# EAGLE design PCB Telemetria 2020 (EAGLE 9.6.2)

## Sheet 1 of 5: TBEAM
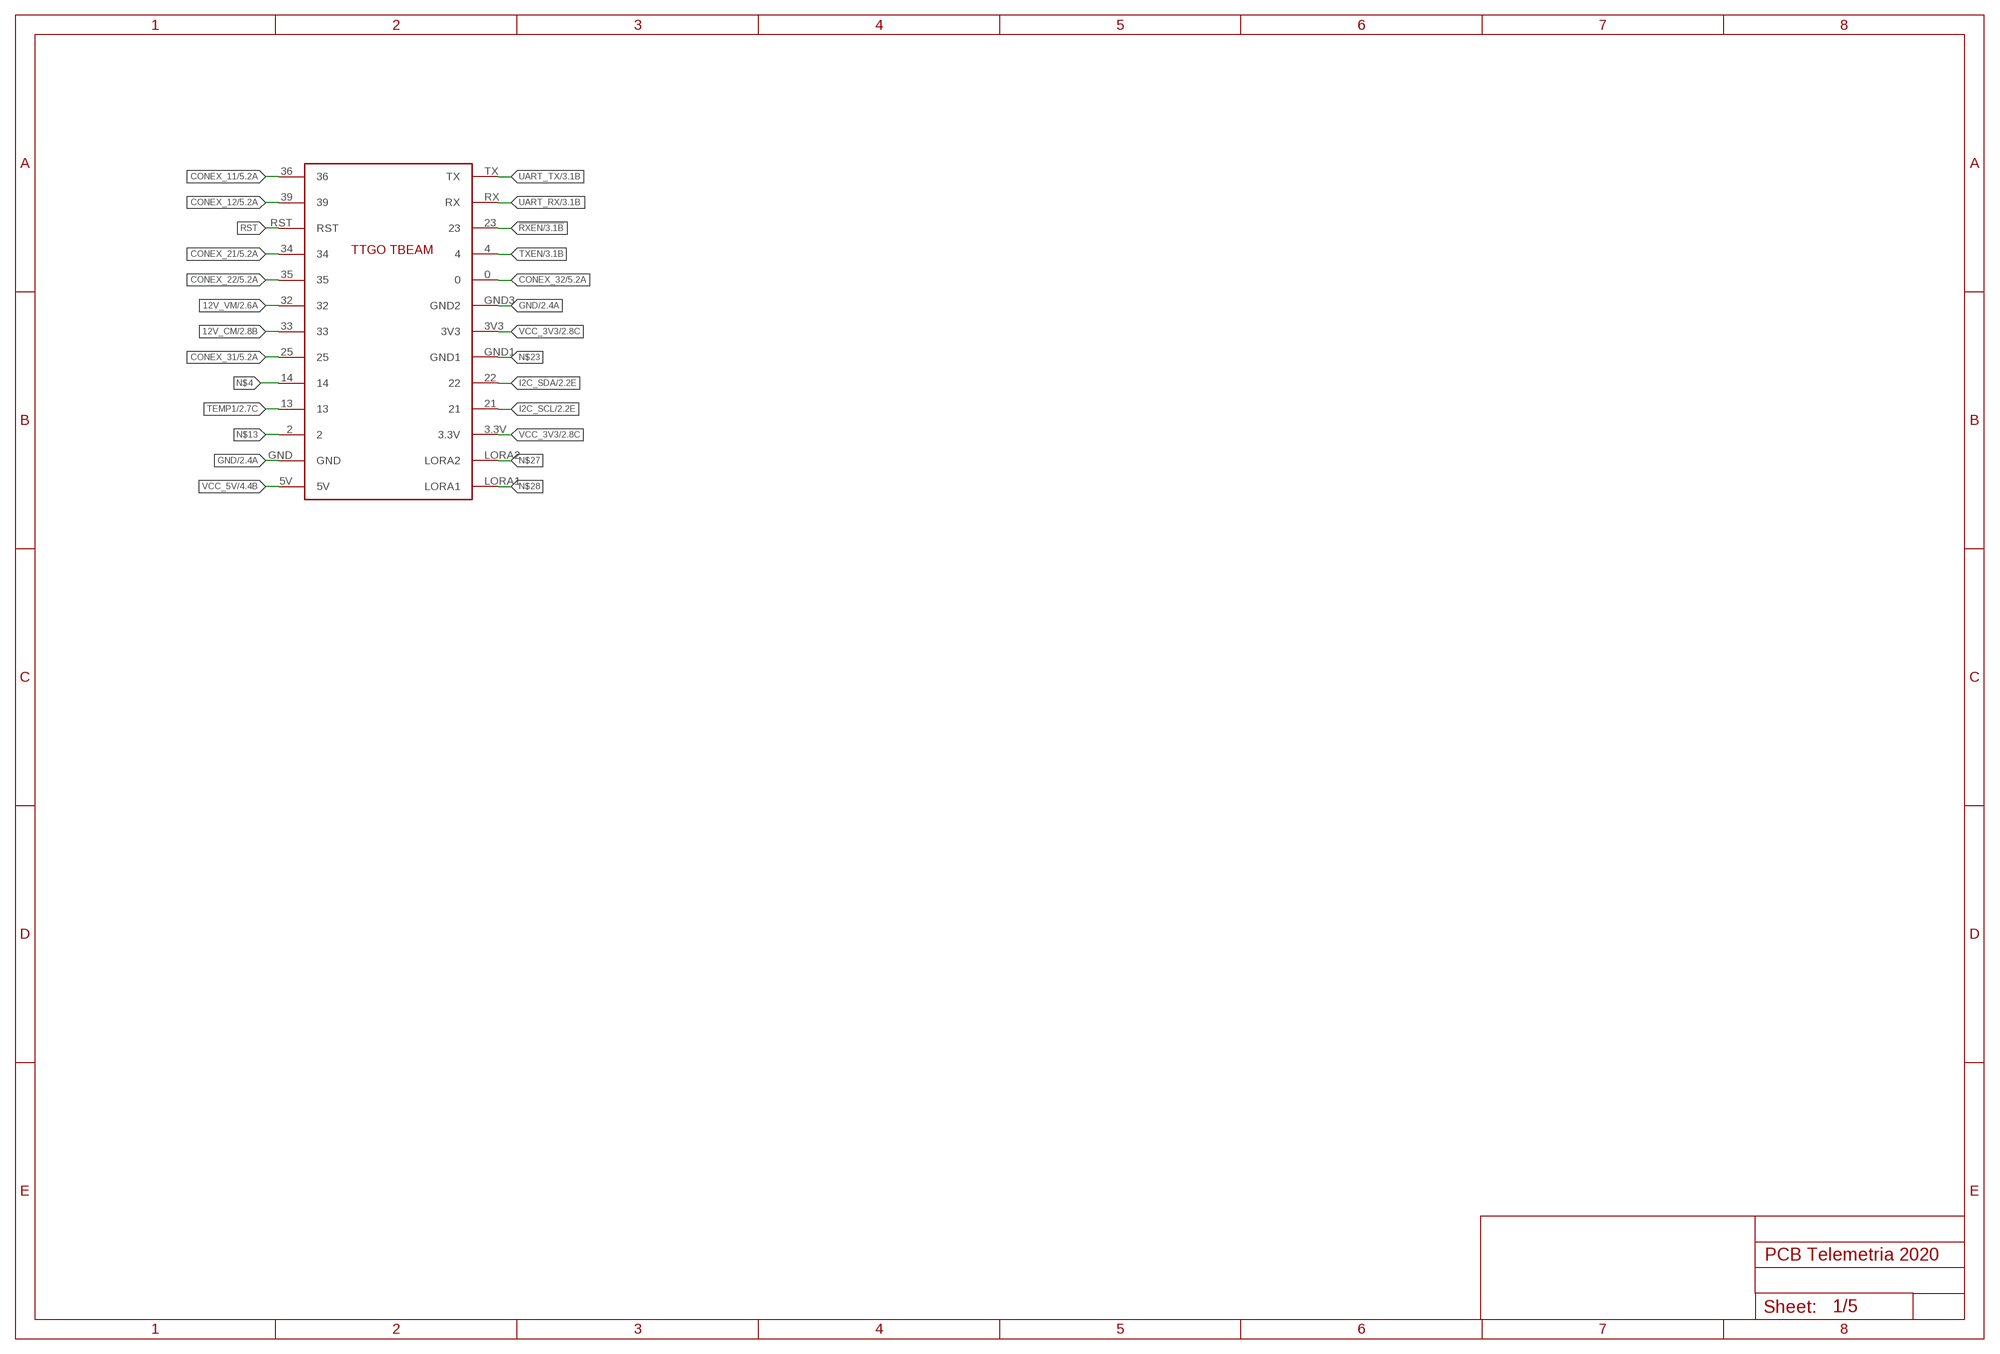
[diagram p0: schematic, sheet 1]

### Parts
U$1  TTGOBEAM  [TTGOBEAM]

### Nets
12V_CM: U$1.33 ; also sheet 2
12V_VM: U$1.32 ; also sheet 2
!RXEN: U$1.23 ; also sheet 3
CONEX_11: U$1.36 ; also sheet 5
CONEX_12: U$1.39 ; also sheet 5
CONEX_21: U$1.34 ; also sheet 5
CONEX_22: U$1.35 ; also sheet 5
CONEX_31: U$1.25 ; also sheet 5
CONEX_32: U$1.0 ; also sheet 5
GND: U$1.GND U$1.GND3(GND2) ; also sheet 2,3,4,5
I2C_SCL: U$1.21 ; also sheet 2
I2C_SDA: U$1.22 ; also sheet 2
N$4: U$1.14
N$13: U$1.2
N$23: U$1.GND1
N$27: U$1.LORA2
N$28: U$1.LORA1
RST: U$1.RST
TEMP1: U$1.13 ; also sheet 2
TXEN: U$1.4 ; also sheet 3
UART_RX: U$1.RX ; also sheet 3
UART_TX: U$1.TX ; also sheet 3
VCC_3V3: U$1.3.3V U$1.3V3 ; also sheet 2,3,4
VCC_5V: U$1.5V ; also sheet 4,5

## Sheet 2 of 5: Analog Circuits
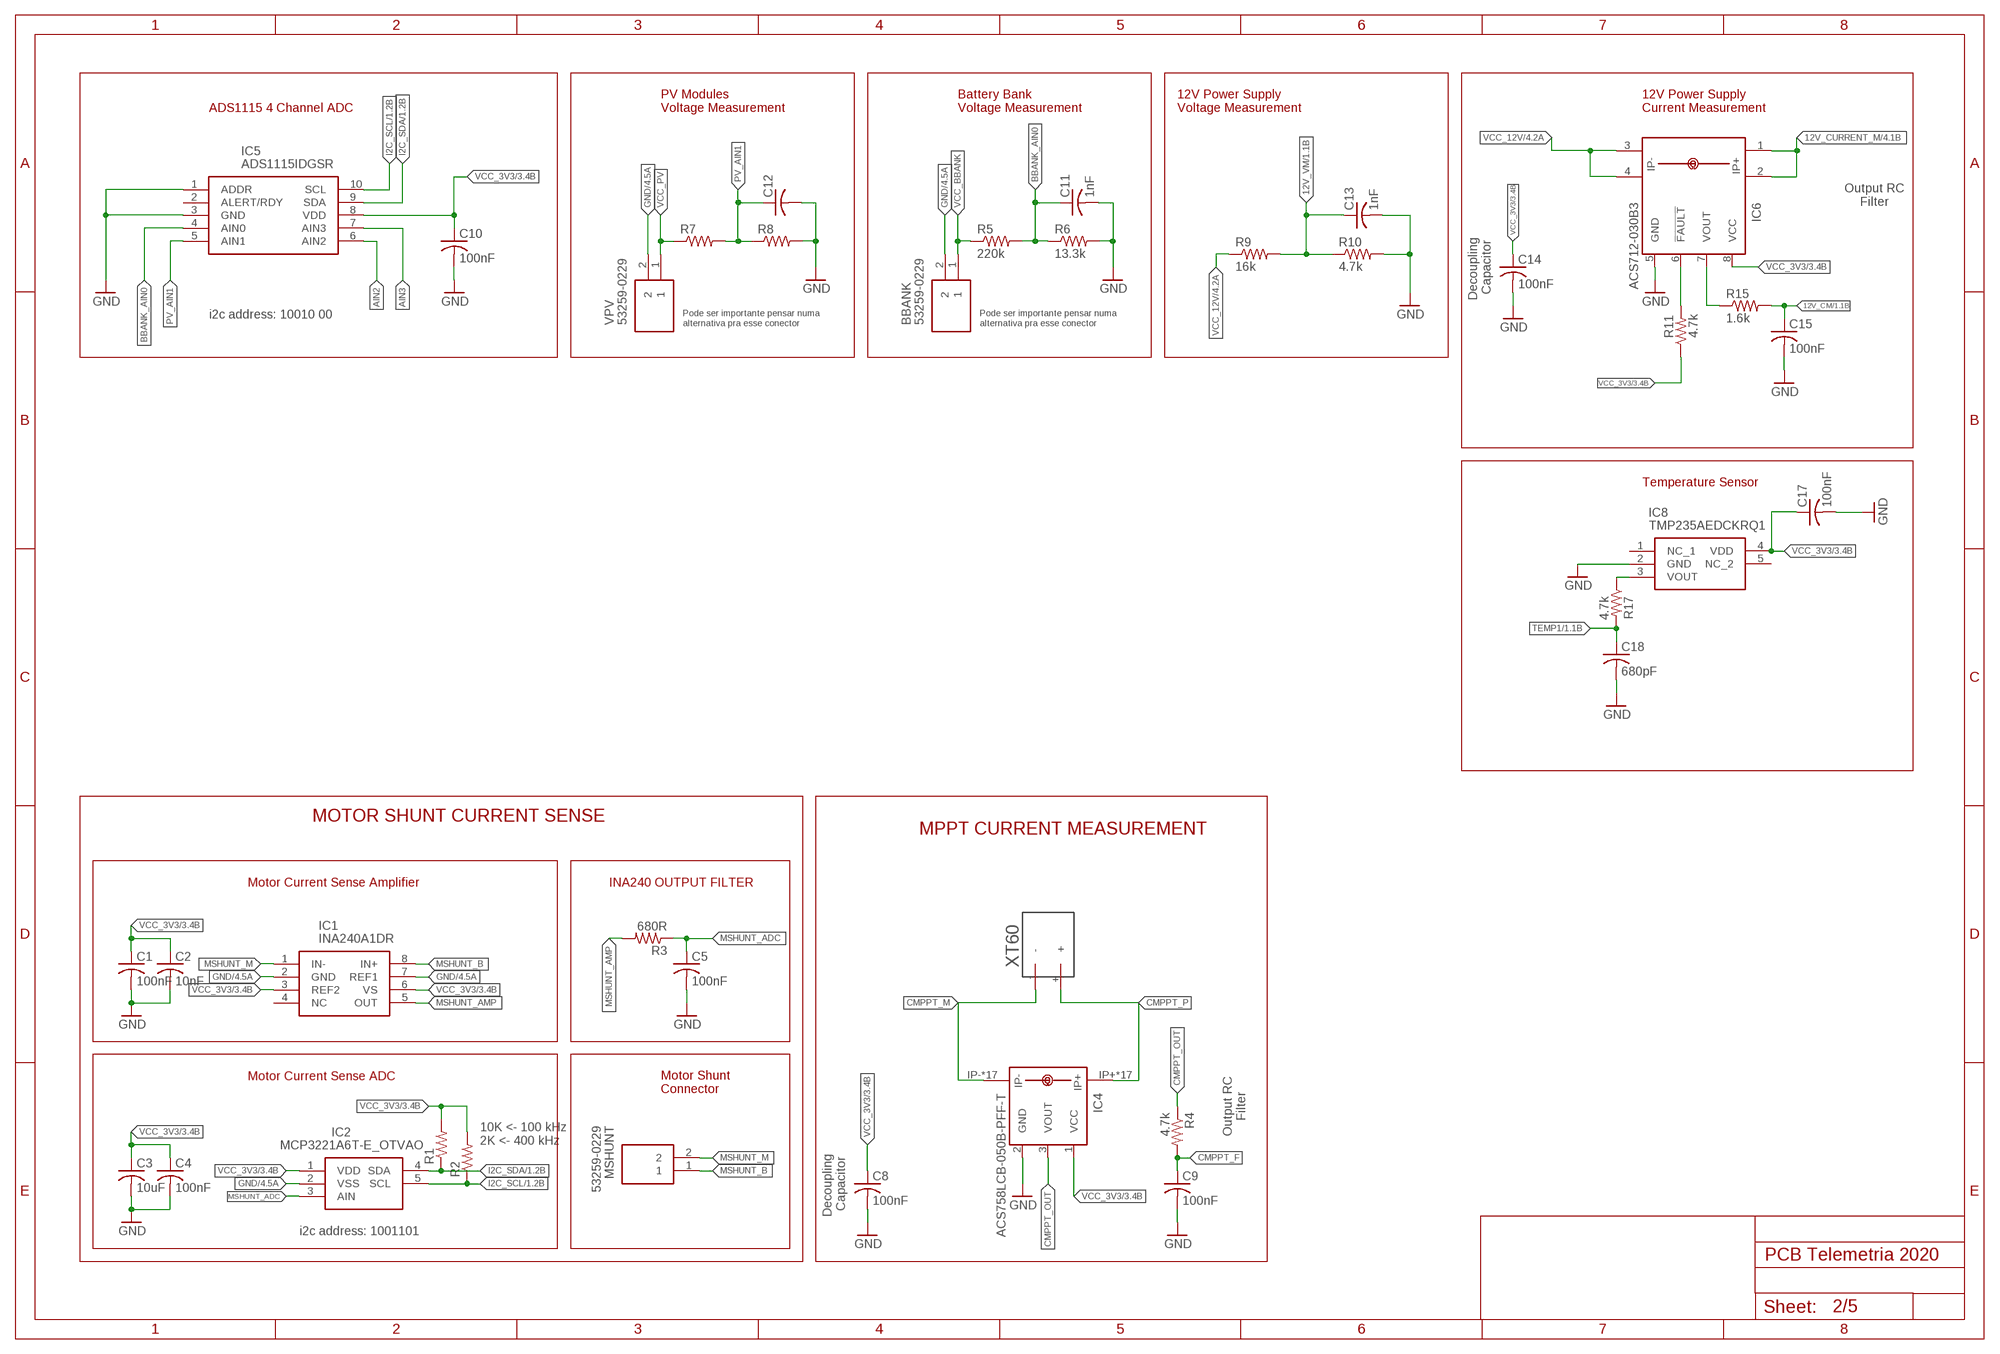
[diagram p1: schematic, sheet 2]

### Parts
BBANK  53259-0229  [0532590229]
C1  100nF  C-USC0805  [C0805]
C2  10nF  C-USC0805  [C0805]
C3  10uF  C-USC0805  [C0805]
C4  100nF  C-USC0805  [C0805]
C5  100nF  C-USC0805  [C0805]
C8  100nF  C-USC0805  [C0805]
C9  100nF  C-USC0805  [C0805]
C10  100nF  C-USC0805  [C0805]
C11  1nF  C-USC0805  [C0805]
C12  C-USC0805  [C0805]
C13  1nF  C-USC0805  [C0805]
C14  100nF  C-USC0805  [C0805]
C15  100nF  C-USC0805  [C0805]
C17  100nF  C-USC0805  [C0805]
C18  680pF  C-USC0805  [C0805]
IC1  INA240A1DR  [SOIC127P600X175-8N]
IC2  MCP3221A6T-E_OTVAO  [SOT95P280X145-5N]
IC4  ACS758LCB-050B-PFF-T  [CB-PFF]
IC5  ADS1115IDGSR  [SOP50P490X110-10N]
IC6  ACS712-030B3  ACS712-LC  [SOIC8]
IC8  TMP235AEDCKRQ1  [SOT65P210X110-5N]
MSHUNT  53259-0229  [0532590229]
R1  R-US_R0805  [R0805]
R2  R-US_R0805  [R0805]
R3  680R  R-US_R0805  [R0805]
R4  4.7k  R-US_R0805  [R0805]
R5  220k  R-US_R0805  [R0805]
R6  13.3k  R-US_R0805  [R0805]
R7  R-US_R0805  [R0805]
R8  R-US_R0805  [R0805]
R9  16k  R-US_R0805  [R0805]
R10  4.7k  R-US_R0805  [R0805]
R11  4.7k  R-US_R0805  [R0805]
R15  1.6k  R-US_R0805  [R0805]
R17  4.7k  R-US_R0805  [R0805]
U$3  XT60  [XT60]
VPV  53259-0229  [0532590229]

### Nets
12V_CM: C15.1 R15.2 ; also sheet 1
12V_CURRENT_M: IC6.1(IP+) IC6.2(IP+1) ; also sheet 4
12V_VM: C13.1 R9.2 R10.1 ; also sheet 1
AIN2: IC5.6(AIN2)
AIN3: IC5.7(AIN3)
BBANK_AIN0: C11.1 IC5.4(AIN0) R5.2 R6.1
CMPPT_F: C9.1 R4.2
CMPPT_M: IC4.IP- IC4.IP-@2(IP-) IC4.IP-@3(IP-) IC4.IP-@4(IP-) IC4.IP-@5(IP-) IC4.IP-@6(IP-) IC4.IP-@7(IP-) IC4.IP-@8(IP-) IC4.IP-@9(IP-) IC4.IP-@10(IP-) IC4.IP-@11(IP-) IC4.IP-@12(IP-) IC4.IP-@13(IP-) IC4.IP-@14(IP-) IC4.IP-@15(IP-) IC4.IP-@16(IP-) IC4.IP-@17(IP-) U$3.-
CMPPT_OUT: IC4.3(VOUT) R4.1
CMPPT_P: IC4.IP+ IC4.IP+@2(IP+) IC4.IP+@3(IP+) IC4.IP+@4(IP+) IC4.IP+@5(IP+) IC4.IP+@6(IP+) IC4.IP+@7(IP+) IC4.IP+@8(IP+) IC4.IP+@9(IP+) IC4.IP+@10(IP+) IC4.IP+@11(IP+) IC4.IP+@12(IP+) IC4.IP+@13(IP+) IC4.IP+@14(IP+) IC4.IP+@15(IP+) IC4.IP+@16(IP+) IC4.IP+@17(IP+) U$3.+
GND: BBANK.2 C1.2 C2.2 C3.2 C4.2 C5.2 C8.2 C9.2 C10.2 C11.2 C12.2 C13.2 C14.2 C15.2 C17.2 C18.2 IC1.2(GND) IC1.7(REF1) IC2.2(VSS) IC4.2(GND) IC5.1(ADDR) IC5.3(GND) IC6.5(GND) IC8.2(GND) R6.2 R8.2 R10.2 VPV.2 ; also sheet 1,3,4,5
I2C_SCL: IC2.5(SCL) IC5.10(SCL) R2.1 ; also sheet 1
I2C_SDA: IC2.4(SDA) IC5.9(SDA) R1.1 ; also sheet 1
MSHUNT_ADC: C5.1 IC2.3(AIN) R3.1
MSHUNT_AMP: IC1.5(OUT) R3.2
MSHUNT_B: IC1.8(IN+) MSHUNT.1
MSHUNT_M: IC1.1(IN-) MSHUNT.2
N$1: IC6.6(!FAULT) R11.2
N$2: IC6.7(VOUT) R15.1
N$3: IC8.3(VOUT) R17.1
PV_AIN1: C12.1 IC5.5(AIN1) R7.2 R8.1
TEMP1: C18.1 R17.2 ; also sheet 1
VCC_3V3: C1.1 C2.1 C3.1 C4.1 C8.1 C10.1 C14.1 C17.1 IC1.3(REF2) IC1.6(VS) IC2.1(VDD) IC4.1(VCC) IC5.8(VDD) IC6.8(VCC) IC8.4(VDD) R1.2 R2.2 R11.1 ; also sheet 1,3,4
VCC_12V: IC6.3(IP-) IC6.4(IP-1) R9.1 ; also sheet 4
VCC_BBANK: BBANK.1 R5.1
VCC_PV: R7.1 VPV.1
Unconnected: IC1.4(NC) IC5.2(ALERT/RDY) IC8.1(NC_1) IC8.5(NC_2)

### Notes on the sheet
- ADS1115 4 Channel ADC
- PV Modules
  Voltage Measurement
- Battery Bank
  Voltage Measurement
- 12V Power Supply
  Voltage Measurement
- 12V Power Supply
  Current Measurement
- Output RC
  Filter
- Decoupling 
  Capacitor
- i2c address: 10010 00
- Pode ser importante pensar numa
  alternativa pra esse conector
- Pode ser importante pensar numa
  alternativa pra esse conector
- Temperature Sensor
- MOTOR SHUNT CURRENT SENSE
- MPPT CURRENT MEASUREMENT
- Motor Current Sense Amplifier | INA240 OUTPUT FILTER
- Motor Current Sense ADC
- Motor Shunt 
  Connector
- Output RC
  Filter
- 10K <- 100 kHz
  2K <- 400 kHz
- Decoupling 
  Capacitor
- i2c address: 1001101

## Sheet 3 of 5: Communication
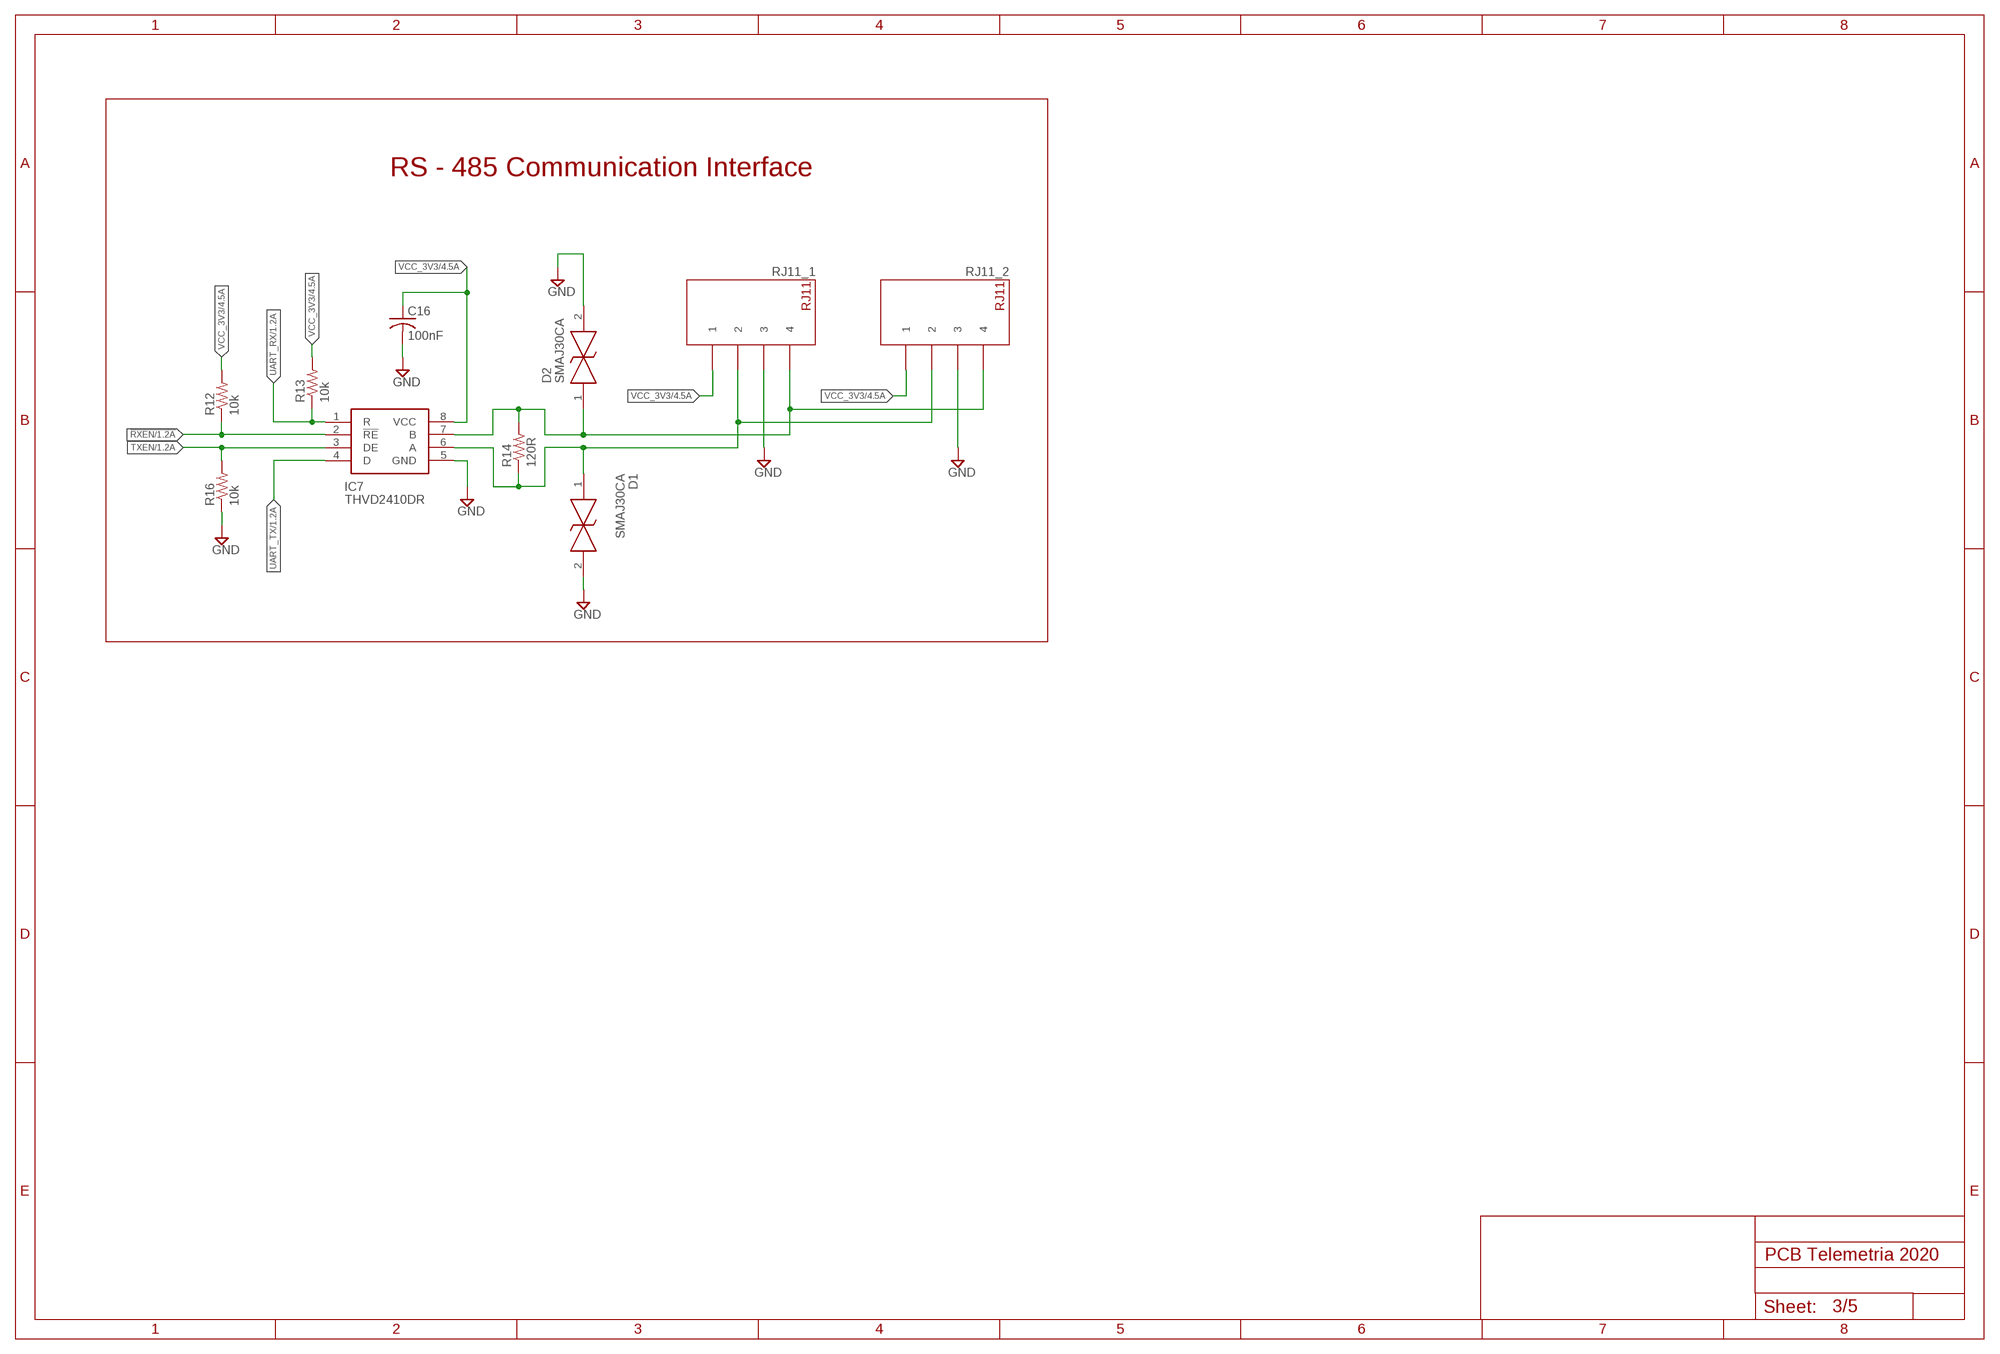
[diagram p2: schematic, sheet 3]

### Parts
C16  100nF  C-USC0805  [C0805]
D1  SMAJ30CA  [DIONM5026X229N]
D2  SMAJ30CA  [DIONM5026X229N]
IC7  THVD2410DR  [SOIC127P600X175-8N]
R12  10k  R-US_M0805  [M0805]
R13  10k  R-US_M0805  [M0805]
R14  120R  R-US_M0805  [M0805]
R16  10k  R-US_M0805  [M0805]
RJ11_1  TFC44  [TFC44]
RJ11_2  TFC44  [TFC44]

### Nets
!RXEN: IC7.2(!RE) R12.1 ; also sheet 1
GND: C16.2 D1.2 D2.2 IC7.5(GND) R16.1 RJ11_1.P$3 RJ11_2.P$3 ; also sheet 1,2,4,5
RS485_A: D1.1 IC7.6(A) R14.1 RJ11_1.P$2 RJ11_2.P$2 ; also sheet 5
RS485_B: D2.1 IC7.7(B) R14.2 RJ11_1.P$4 RJ11_2.P$4 ; also sheet 5
TXEN: IC7.3(DE) R16.2 ; also sheet 1
UART_RX: IC7.1(R) R13.1 ; also sheet 1
UART_TX: IC7.4(D) ; also sheet 1
VCC_3V3: C16.1 IC7.8(VCC) R12.2 R13.2 RJ11_1.P$1 RJ11_2.P$1 ; also sheet 1,2,4

### Notes on the sheet
- RS - 485 Communication Interface

## Sheet 4 of 5: Power
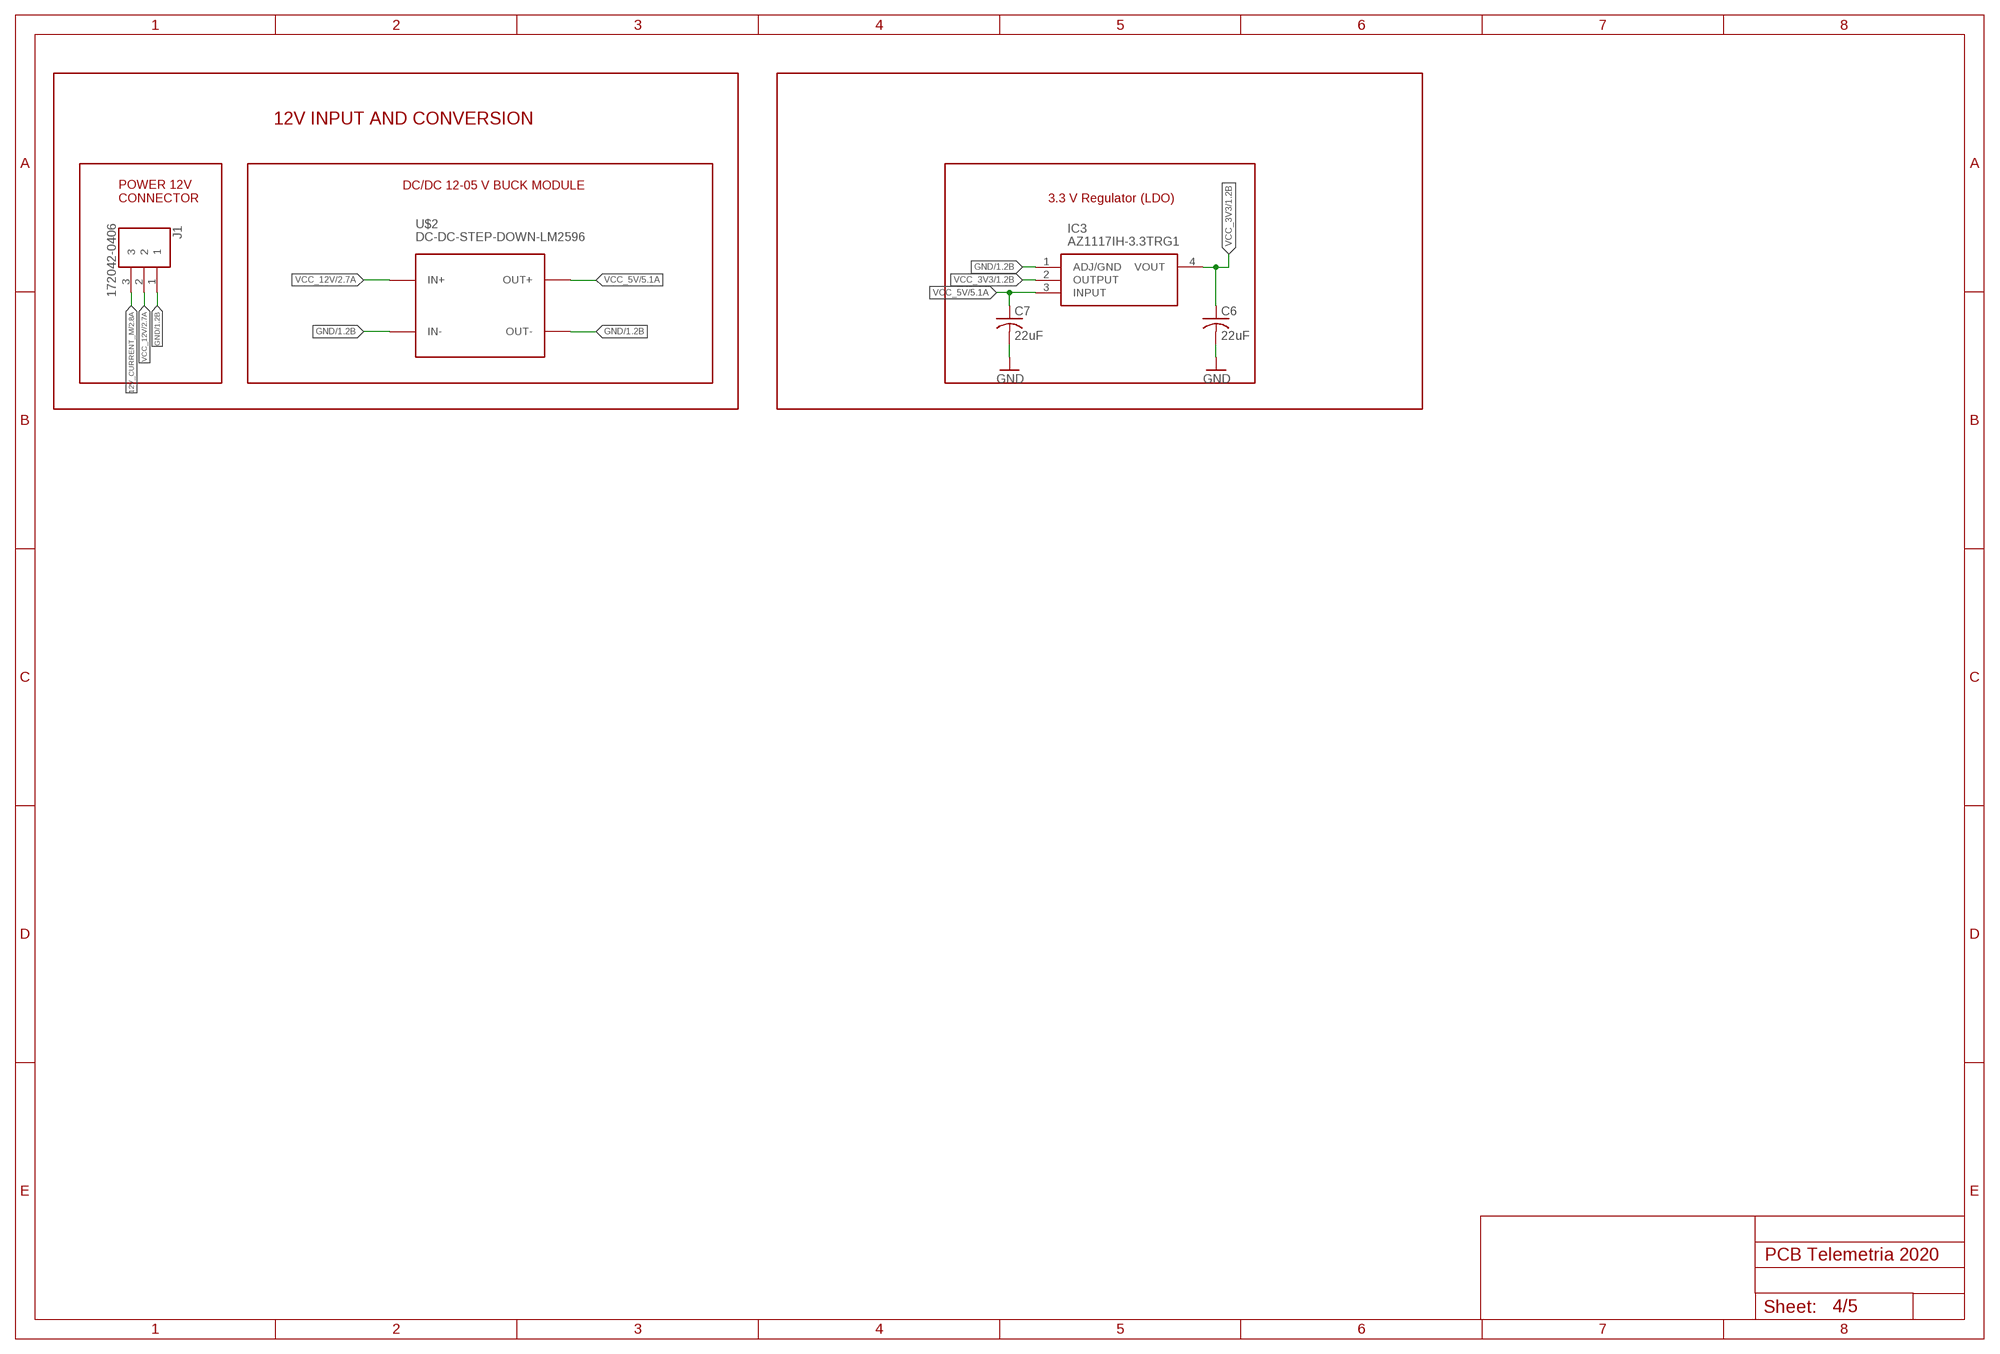
[diagram p3: schematic, sheet 4]

### Parts
C6  22uF  C-USC0805  [C0805]
C7  22uF  C-USC0805  [C0805]
IC3  AZ1117IH-3.3TRG1  [SOT230P700X170-4N]
J1  172042-0406  [MOLEX_172042-0406]
U$2  DC-DC-STEP-DOWN-LM2596  [DC-DC-STEP-DOWN-LM2596]

### Nets
12V_CURRENT_M: J1.3 ; also sheet 2
GND: C6.2 C7.2 IC3.1(ADJ/GND) J1.1 U$2.IN- U$2.OUT- ; also sheet 1,2,3,5
VCC_3V3: C6.1 IC3.2(OUTPUT) IC3.4(VOUT) ; also sheet 1,2,3
VCC_5V: C7.1 IC3.3(INPUT) U$2.OUT+ ; also sheet 1,5
VCC_12V: J1.2 U$2.IN+ ; also sheet 2

### Notes on the sheet
- 12V INPUT AND CONVERSION
- DC/DC 12-05 V BUCK MODULE
- POWER 12V
  CONNECTOR
- 3.3 V Regulator (LDO)

## Sheet 5 of 5: Extra Connectors
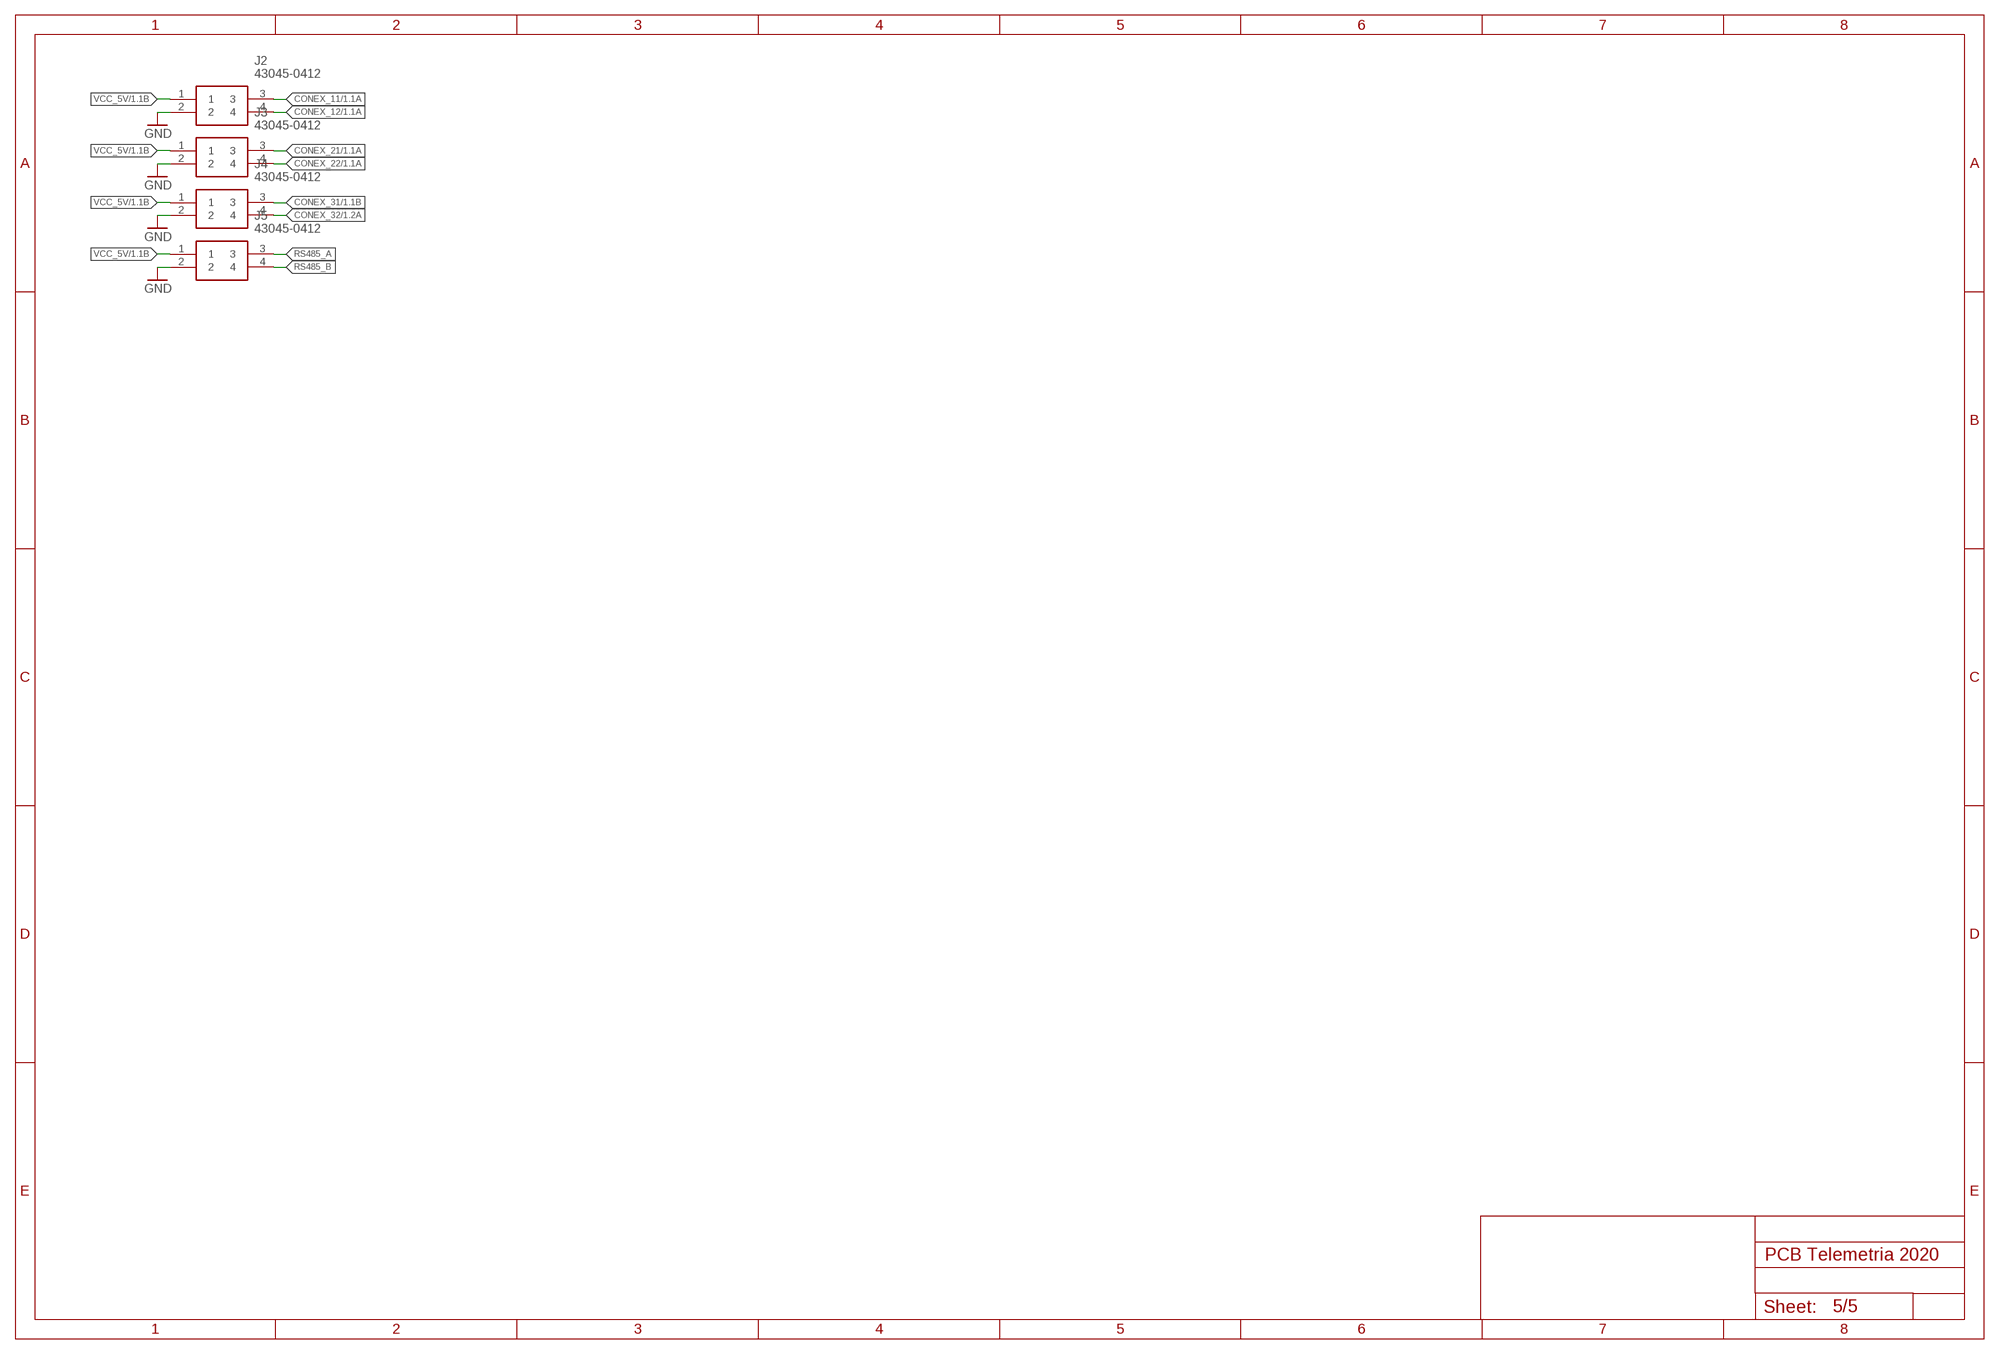
[diagram p4: schematic, sheet 5]

### Parts
J2  43045-0412  [43045-0412]
J3  43045-0412  [43045-0412]
J4  43045-0412  [43045-0412]
J5  43045-0412  [43045-0412]

### Nets
CONEX_11: J2.3 ; also sheet 1
CONEX_12: J2.4 ; also sheet 1
CONEX_21: J3.3 ; also sheet 1
CONEX_22: J3.4 ; also sheet 1
CONEX_31: J4.3 ; also sheet 1
CONEX_32: J4.4 ; also sheet 1
GND: J2.2 J3.2 J4.2 J5.2 ; also sheet 1,2,3,4
RS485_A: J5.3 ; also sheet 3
RS485_B: J5.4 ; also sheet 3
VCC_5V: J2.1 J3.1 J4.1 J5.1 ; also sheet 1,4

## Library data of the parts
BBANK MSHUNT VPV = CON_MOLEX_53259-0229:53259-0229: Headers & Wire Housings 3.5 WtB Wafer Assy R B Wafer Assy RA 2Ckt Source: Datasheet <https://www.molex.com/webdocs/datasheets/pdf/en-us/0532590229_PCB_HEADERS.pdf>; DESCRIPTION: Headers & Wire Housings 3.5 WtB Wafer Assy R B Wafer Assy RA 2Ckt; HEIGHT: 7mm; MANUFACTURER_NAME: Molex; MANUFACTURER_PART_NUMBER: 53259-0229; MOUSER_PART_NUMBER: 538-53259-0229; MOUSER_PRICE-STOCK: https://www.mouser.co.uk/ProductDetail/Molex/53259-0229?qs=%2Fy5FSpUmAiGN4PmFvaThpA%3D%3D
C1-C18 = rcl:C-US: CAPACITOR, American symbol; SPICEPREFIX: C
D1 D2 = SamacSys_Parts:SMAJ30CA: Littelfuse SMAJ30CA, Bi-Directional TVS Diode, 400W, 2-Pin DO-214AC Source: Datasheet <https://www.mouser.se/datasheet/2/240/Littelfuse_TVS_Diode_SMAJ_Datasheet.pdf-540740.pdf>; DESCRIPTION: Littelfuse SMAJ30CA, Bi-Directional TVS Diode, 400W, 2-Pin DO-214AC; HEIGHT: 2.29mm; MANUFACTURER_NAME: LITTELFUSE; MANUFACTURER_PART_NUMBER: SMAJ30CA; MOUSER_PART_NUMBER: 576-SMAJ30CA; MOUSER_PRICE-STOCK: https://www.mouser.co.uk/ProductDetail/Littelfuse/SMAJ30CA?qs=HR2RnyOI4E7JQai5qAA1IA%3D%3D
IC1 = INA240A1DR:INA240A1DR: 80V, Low-/High-Side, Bi-Directional, Zero-Drift, Current Sense Amp w/Enhanced PWM Rejection Source: Datasheet <http://www.ti.com/lit/gpn/ina240>; DESCRIPTION: 80V, Low-/High-Side, Bi-Directional, Zero-Drift, Current Sense Amp w/Enhanced PWM Rejection; HEIGHT: 1.75mm; MANUFACTURER_NAME: Texas Instruments; MANUFACTURER_PART_NUMBER: INA240A1DR; MOUSER_PART_NUMBER: 595-INA240A1DR; MOUSER_PRICE-STOCK: https://www.mouser.co.uk/ProductDetail/Texas-Instruments/INA240A1DR?qs=AQlKX63v8Rv7XB07RTzuHA%3D%3D
IC2 = MCP3221A6T-E_OTVAO:MCP3221A6T-E_OTVAO: Analog to Digital Converters - ADC Automotive, 12-bit SAR ADC, I2C, single channel Source: Datasheet <https://www.arrow.com/en/products/mcp3221a6t-eotvao/microchip-technology>; DESCRIPTION: Analog to Digital Converters - ADC Automotive, 12-bit SAR ADC, I2C, single channel; HEIGHT: 1.45mm; MANUFACTURER_NAME: Microchip; MANUFACTURER_PART_NUMBER: MCP3221A6T-E/OTVAO; MOUSER_PART_NUMBER: 579-MCP3221A6TEOTVAO; MOUSER_PRICE-STOCK: https://www.mouser.co.uk/ProductDetail/Microchip-Technology/MCP3221A6T-E-OTVAO?qs=5aG0NVq1C4xIe7K3D%2FHE6g%3D%3D
IC3 = AZ1117IH-3.3TRG1:AZ1117IH-3.3TRG1: LDO Voltage Regulators LDO BJT HiCurr 1.35A 10Hz to 10KHz Source: Datasheet; DESCRIPTION: LDO Voltage Regulators LDO BJT HiCurr 1.35A 10Hz to 10KHz; HEIGHT: 1.7mm; MANUFACTURER_NAME: Diodes Inc.; MANUFACTURER_PART_NUMBER: AZ1117IH-3.3TRG1; MOUSER_PART_NUMBER: 621-AZ1117IH-3.3TRG1; MOUSER_PRICE-STOCK: https://www.mouser.co.uk/ProductDetail/Diodes-Incorporated/AZ1117IH-33TRG1?qs=cpo3%2FpBou2jnS4SxLgAVoA%3D%3D
IC4 = allegro:ACS758*: Thermally Enhanced, Fully Integrated, Hall Effect-Based Linear Current Sensor with 100 micro Ohm Current Conductor display layer 49 Reference in BRD and place VIAs on circles Source: http://www.allegromicro.com/en/Products/Part_Numbers/0758/0758.pdf; MPN: ACS758LCB-050B-PFF-T; OC_FARNELL: 1718997; OC_NEWARK: 04R7131
IC5 = SamacSys_Parts:ADS1115IDGSR: 16-Bit 860SPS 4-Ch Delta-Sigma ADC With PGA, Oscillator, Vref, Comparator, and I2C Source: Datasheet <http://www.ti.com/lit/gpn/ADS1115>; DESCRIPTION: 16-Bit 860SPS 4-Ch Delta-Sigma ADC With PGA, Oscillator, Vref, Comparator, and I2C; HEIGHT: 1.1mm; MANUFACTURER_NAME: Texas Instruments; MANUFACTURER_PART_NUMBER: ADS1115IDGSR; MOUSER_PART_NUMBER: 595-ADS1115IDGSR; MOUSER_PRICE-STOCK: https://www.mouser.co.uk/ProductDetail/Texas-Instruments/ADS1115IDGSR?qs=IK5e5L0zOXjKCJoVMhYO%2FQ%3D%3D
IC6 = allegro-2:ACS712-LC
IC7 = SamacSys_Parts:THVD2410DR: RS-485 Interface IC Source: Datasheet <https://www.ti.com/lit/ds/symlink/thvd2410.pdf>; DESCRIPTION: RS-485 Interface IC; HEIGHT: 1.75mm; MANUFACTURER_NAME: Texas Instruments; MANUFACTURER_PART_NUMBER: THVD2410DR; MOUSER_PART_NUMBER: 595-THVD2410DR; MOUSER_PRICE-STOCK: https://www.mouser.co.uk/ProductDetail/Texas-Instruments/THVD2410DR?qs=%252B6g0mu59x7L2L8jrQVCEYQ%3D%3D
IC8 = SamacSys_Parts:TMP235AEDCKRQ1: Board Mount Temperature Sensors Automotive grade, +/-0.5C analog output temperature sensor with 10 mV/C gain 5-SC70 -40 to 150 Source: Datasheet <https://www.ti.com/lit/gpn/TMP235-Q1>; DESCRIPTION: Board Mount Temperature Sensors Automotive grade, +/-0.5C analog output temperature sensor with 10 mV/C gain 5-SC70 -40 to 150; HEIGHT: 1.1mm; MANUFACTURER_NAME: Texas Instruments; MANUFACTURER_PART_NUMBER: TMP235AEDCKRQ1; MOUSER_PART_NUMBER: 595-TMP235AEDCKRQ1; MOUSER_PRICE-STOCK: https://www.mouser.co.uk/ProductDetail/Texas-Instruments/TMP235AEDCKRQ1?qs=T3oQrply3y86j8c6PmMwyA%3D%3D
J1 = 172042-0302:172042-0406: Super Sabre™ Vertical Header, 3 Circuit, Short Tail with Board Lock, Complies with the UL1977 finger proof stan; AVAILABILITY: Warning; DESCRIPTION: 3 Position Header, Male Blades Connector Solder 0.295 (7.50mm) Through Hole; MF: Molex; MP: 172042-0302; PACKAGE: None; PRICE: None
J2-J5 = SamacSys_Parts:43045-0412: Headers & Wire Housings 4 CKT VERT HEADER Source: Datasheet; DESCRIPTION: Headers & Wire Housings 4 CKT VERT HEADER; HEIGHT: mm; MANUFACTURER_NAME: Molex; MANUFACTURER_PART_NUMBER: 43045-0412; MOUSER_PART_NUMBER: 538-43045-0412; MOUSER_PRICE-STOCK: https://www.mouser.co.uk/ProductDetail/Molex/43045-0412?qs=UeCeOHRHQebPBbEMDLocEw%3D%3D
R1-R17 = rcl:R-US_: RESISTOR, American symbol; SPICEPREFIX: R
RJ11_1 RJ11_2 = Painel-Facilidades:TFC44
U$1 = bibliotecattgo:TTGOBEAM
U$2 = diy-modules:DC-DC-STEP-DOWN-LM2596: DC/DC Step-Down Regulator based on LM2596-ADJ chip LM2596 datasheet available here: http://www.ti.com/lit/ds/symlink/lm2596.pdf Click here to find device on ebay.com <http://www.ebay.com/sch/lm2596+power+regulator>
U$3 = XT60:XT60: XT60

## Board
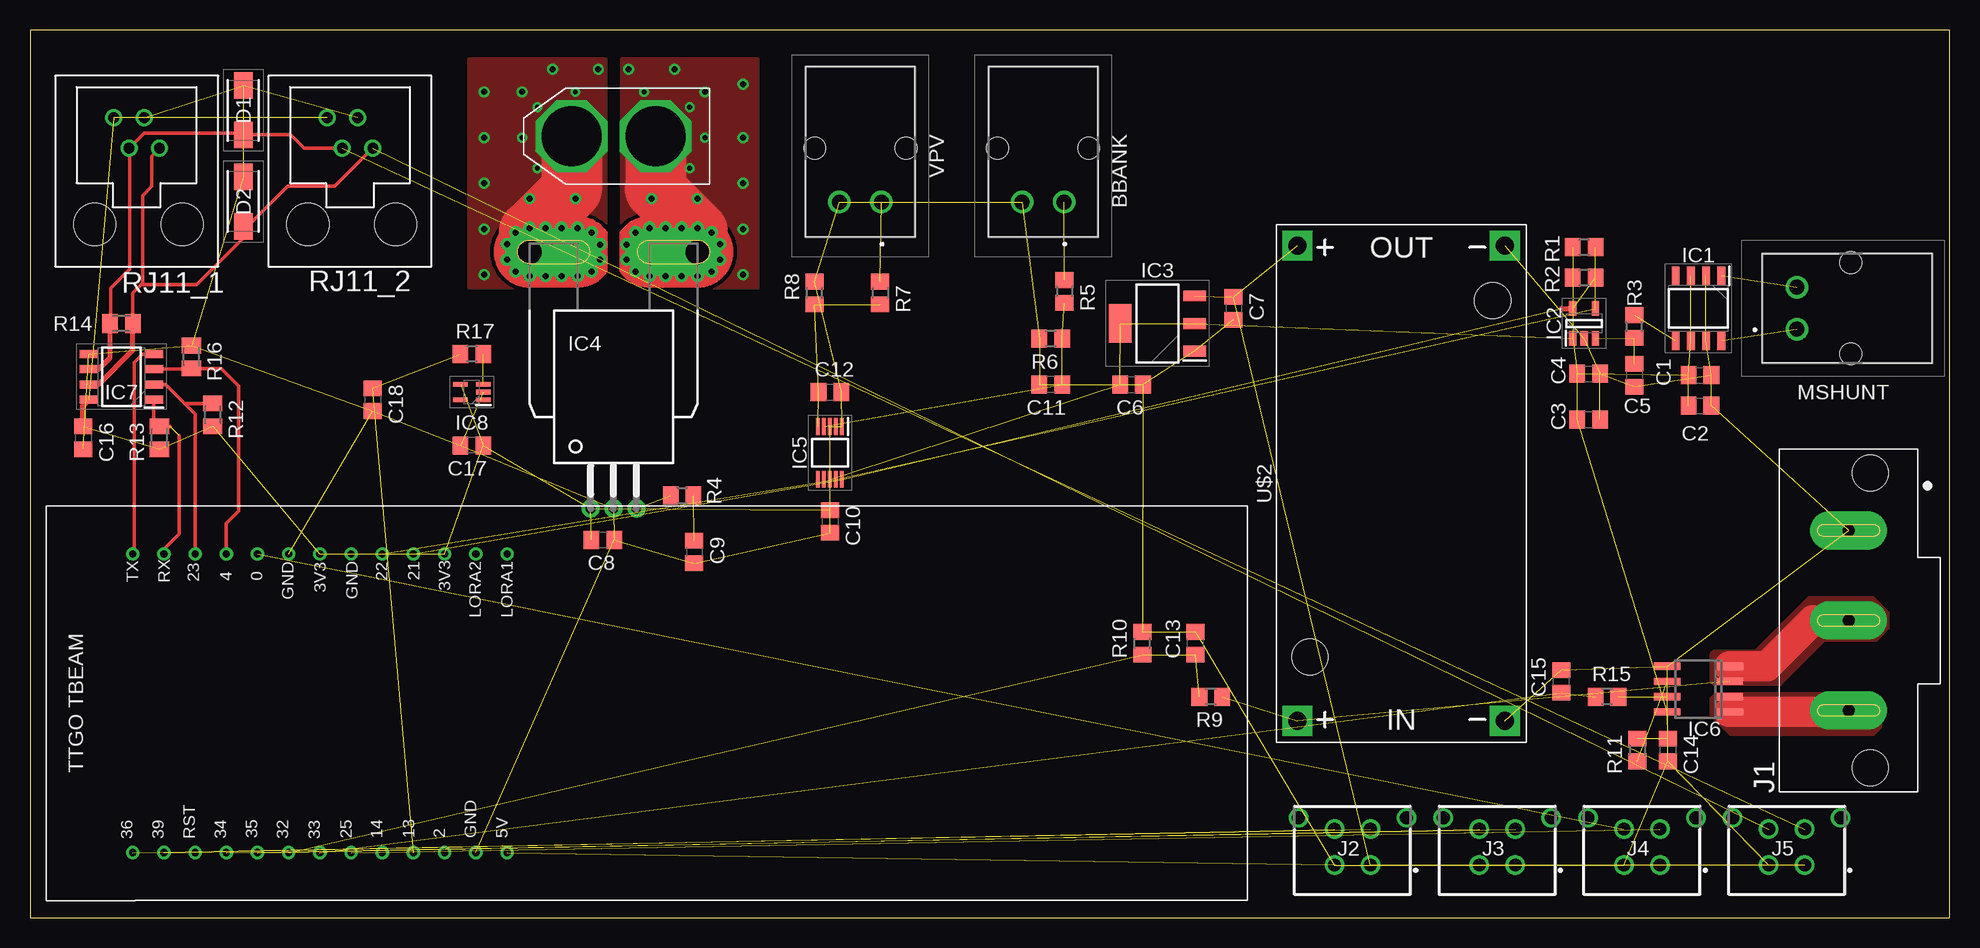
[diagram p5: board, top side]
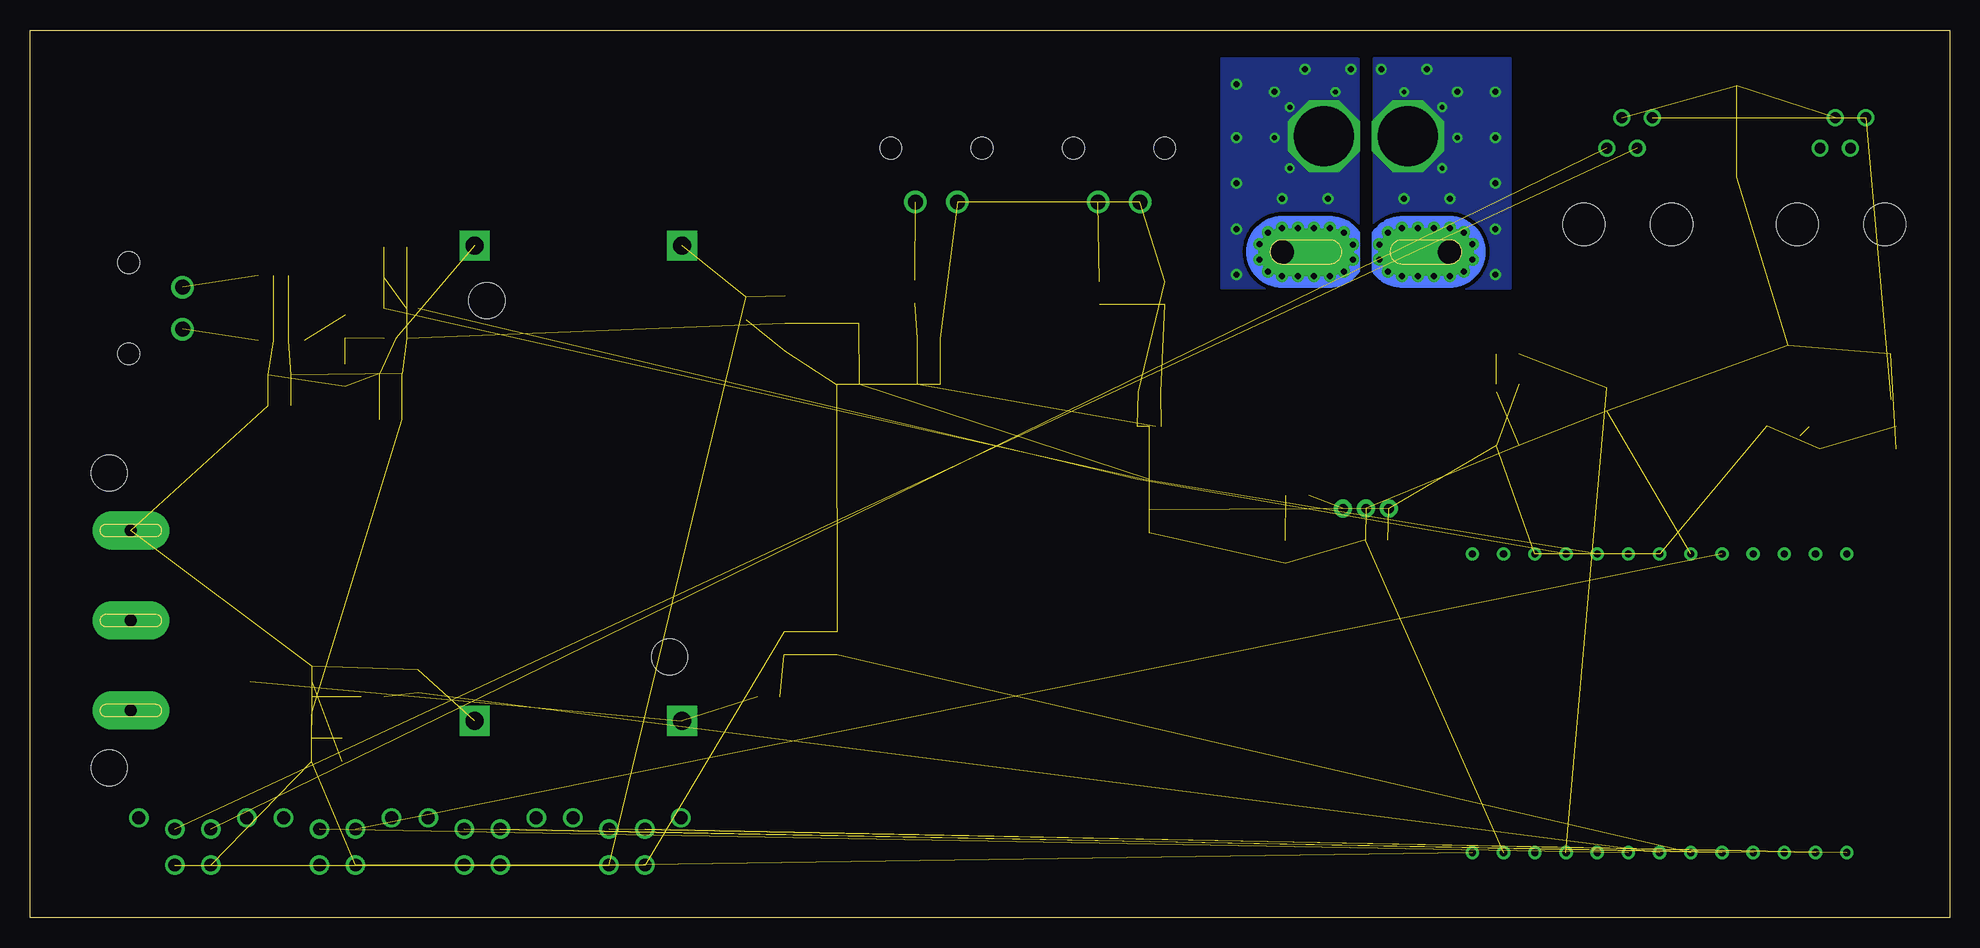
[diagram p6: board, bottom side, seen from below]

Size 160 x 74 mm. Coordinates in mm from the lower left corner, seen from the top.
Outline: 0,0 160,0 160,74 0,74 0,0
Copper layers (1*16): Top 0.07mm / dielectric 1.5mm / Bottom 0.07mm
Design rules "default *": minimum track width 12mil, minimum drill 0.35mm, track to track 12mil, track to pad 16mil, pad to pad 5mil, via to via 16mil, smd to smd 6mil, copper to edge 40mil, drill to drill 6mil, minimum pad ring 10mil, minimum via ring 8mil, stop-mask expansion 4mil, vias tented up to drill 0mil, thermal gap 10mil

### Footprints (pad centres in the part's own frame; a part is rotated, then mirrored left to right if it is on the bottom)
0532590229 = drill 1.25 pad 1.875: 1 -1.75,3.85; 2 1.75,3.85 | hole 1.8: 3.8,-0.65; -3.8,-0.65
C0805 = smd 1.3 x 1.5: 1 -0.95,0; 2 0.95,0
DIONM5026X229N = smd 2.2 x 1.55: 1 -2.05,0; 2 2.05,0
SOIC127P600X175-8N = smd 1.528 x 0.65: 1 -2.711,1.905; 2 -2.711,0.635; 3 -2.711,-0.635; 4 -2.711,-1.905; 5 2.711,-1.905; 6 2.711,-0.635; 7 2.711,0.635; 8 2.711,1.905
SOT95P280X145-5N = smd 1.2 x 0.6: 1 -1.25,0.95; 2 -1.25,0; 3 -1.25,-0.95; 4 1.25,-0.95; 5 1.25,0.95
SOT230P700X170-4N = smd 1.85 x 0.9: 1 -3.1,2.3; 2 -3.1,0; 3 -3.1,-2.3 | smd 1.85 x 3.2: 4 3.1,0
CB-PFF = drill 0.8 pad 1.5: 1 -1.91,-21.4; 2 0,-21.4; 3 1.91,-21.4 | drill 2 pad 4 offset: IP+ 7,0; IP- -7,0 | drill 0.5 pad 0.9: IP+@2 8.89,0.635; IP+@3 8.89,-0.635; IP+@4 8.175,-1.625; IP+@5 7,-2; IP+@6 5.675,-2; IP+@7 4.35,-2; IP+@8 3,-2; IP+@9 1.825,-1.625; IP+@10 1.1,-0.625; IP+@11 1.1,0.625; IP+@12 1.825,1.625; IP+@13 3,2; IP+@14 4.35,2; IP+@15 5.675,2; IP+@16 7,2; IP+@17 8.175,1.625; IP-@2 -8.89,0.635; IP-@3 -8.89,-0.635; IP-@4 -8.175,-1.625; IP-@5 -7,-2; IP-@6 -5.675,-2; IP-@7 -4.325,-2; IP-@8 -3,-2; IP-@9 -1.825,-1.625; IP-@10 -1.1,-0.625; IP-@11 -1.1,0.625; IP-@12 -1.825,1.625; IP-@13 -3,2; IP-@14 -4.325,2; IP-@15 -5.675,2; IP-@16 -7,2; IP-@17 -8.175,1.625
SOP50P490X110-10N = smd 1.4 x 0.3: 1 -2.2,1; 2 -2.2,0.5; 3 -2.2,0; 4 -2.2,-0.5; 5 -2.2,-1; 6 2.2,-1; 7 2.2,-0.5; 8 2.2,0; 9 2.2,0.5; 10 2.2,1
SOIC8 = smd 0.6 x 2.2: 1 -1.905,-2.6; 2 -0.635,-2.6; 3 0.635,-2.6; 4 1.905,-2.6; 5 1.905,2.6; 6 0.635,2.6; 7 -0.635,2.6; 8 -1.905,2.6
SOT65P210X110-5N = smd 1.2 x 0.4: 1 -0.95,0.65; 2 -0.95,0; 3 -0.95,-0.65; 4 0.95,-0.65; 5 0.95,0.65
MOLEX_172042-0406 = drill 1 pad 3.2 long: 1 7.508,2.075; 2 0,2.075; 3 -7.508,2.075 | hole 3: 12.298,0.27; -12.298,0.27
43045-0412 = drill 1.07 pad 1.62: 1 6.325,2.47; 2 3.325,2.47; 3 6.325,5.47; 4 3.325,5.47; 5 0.325,6.41; 6 9.325,6.41
R0805 = smd 1.3 x 1.5: 1 -0.95,0; 2 0.95,0
M0805 = smd 1.3 x 1.6: 1 -0.95,0; 2 0.95,0
TFC44 = drill 0.9: P$1 -1.905,4.45; P$2 -0.635,1.905; P$3 0.635,4.45; P$4 1.905,1.905 | hole 3.5: -3.5,-4.445; 3.8,-4.445
TTGOBEAM = drill 0.6: 0 11.9,5.8; 2 -13,-9.8; 3.3V 11.9,-9.8; 3V3 11.9,0.6; 4 11.9,8.4; 5V -13,-15; 13 -13,-7.2; 14 -13,-4.6; 21 11.9,-7.2; 22 11.9,-4.6; 23 11.9,11; 25 -13,-2; 32 -13,3.2; 33 -13,0.6; 34 -13,8.4; 35 -13,5.8; 36 -13,16.2; 39 -13,13.6; GND -13,-12.4; GND1 11.9,-2; GND3 11.9,3.2; LORA1 11.9,-15; LORA2 11.9,-12.4; RST -13,11; RX 11.9,13.6; TX 11.9,16.2
DC-DC-STEP-DOWN-LM2596 = drill 1.5 pad 2.5 square: IN+ -19.812,8.636; IN- -19.812,-8.636; OUT+ 19.812,8.636; OUT- 19.812,-8.636 | hole 3: -14.478,7.62; 15.24,-7.62
XT60 = drill 5 octagon: + 4.5,0; - 11.5,0

### Placement (x,y rotation side)
BBANK  84.45,63.5 180 top
C1  139.19,45.21 0 top
C2  139.19,42.67 0 top
C3  129.92,41.53 0 top
C4  129.92,45.34 0 top
C5  133.73,45.21 270 top
C6  91.82,44.45 0 top
C7  100.33,50.8 270 top
C8  47.75,31.5 0 top
C9  55.37,30.48 270 top
C10  66.67,33.02 270 top
C11  85.09,44.45 180 top
C12  66.67,43.81 0 top
C13  97.16,22.86 90 top
C14  136.53,13.97 270 top
C15  127.64,19.68 90 top
C16  4.45,40.01 270 top
C17  36.83,39.37 180 top
C18  28.57,43.18 270 top
D1  17.78,67.31 90 top
D2  17.78,59.69 90 top
IC1  139.06,50.8 270 top
IC2  129.54,49.53 90 top
IC3  93.98,49.53 180 top
IC4  48.64,55.5 0 top
IC5  66.67,38.73 270 top
IC6  139.06,19.05 90 top
IC7  7.62,45.09 180 top
IC8  36.83,43.81 180 top
J1  153.67,24.77 90 top
J2  105.41,1.91 0 top
J3  117.47,1.91 0 top
J4  129.54,1.91 0 top
J5  141.6,1.91 0 top
MSHUNT  151.13,50.8 90 top
R1  129.54,55.88 180 top
R2  129.54,53.34 180 top
R3  133.73,49.28 90 top
R4  54.36,35.18 0 top
R5  86.23,52.2 270 top
R6  85.09,48.26 180 top
R7  70.87,52.07 270 top
R8  65.41,52.07 90 top
R9  98.42,18.41 180 top
R10  92.71,22.86 90 top
R11  133.99,13.97 270 top
R12  15.24,41.91 270 top
R13  10.79,40.01 270 top
R14  7.62,49.53 0 top
R15  131.44,18.41 180 top
R16  13.46,46.74 270 top
R17  36.83,46.99 180 top
RJ11_1  8.89,62.23 0 top
RJ11_2  26.67,62.23 0 top
U$1  24.77,18.41 90 top
U$2  114.3,36.2 90 top
U$3  56.64,65.15 180 top
VPV  69.22,63.5 180 top

### Tracks (layer width: path | path; a pad name or v marks a point on that pad's centre or on a via)
12V_CM  (2 unrouted)
12V_CURRENT_M
  Top 0.406: IC6.2 IC6.1
  Top 2.54: J1.3 151.48,17.14 IC6.1
  pour Top (no thermals): 140.08,18.29 140.08,16.89 141.73,15.24 153.67,15.24 154.31,15.88 154.31,17.78 153.42,18.67 140.46,18.67
12V_VM  (3 unrouted)
!RXEN
  Top 0.305: U$1.23 13.77,41.99 12.95,42.8 | 12.95,42.8 11.3,44.45 IC7.2 | R12.1 13.02,42.86 12.95,42.8
BBANK_AIN0  (3 unrouted)
CMPPT_F  (1 unrouted)
CMPPT_M  (via drill 0.4 pad 0.55, 0.5 pad 0.75)
  Top 5.08: IC4.IP- 41.64,57.2 45.14,60.71 U$3.-
  other vias: 37.85,53.59 37.85,57.4 37.85,61.21 37.85,65.02 37.85,68.83 41.66,59.94 45.47,59.94 41.02,68.83 43.56,70.74 47.37,70.74 45.47,68.83 42.29,67.56 41.02,65.02 42.29,62.48
  pour Top (no thermals): 36.58,52.45 36.58,71.63 48.01,71.63 48.01,52.45
  pour Bottom (no thermals): 36.58,52.45 36.58,71.63 48.01,71.63 48.01,52.45
CMPPT_OUT  (1 unrouted)
CMPPT_P  (via drill 0.4 pad 0.55, 0.5 pad 0.75)
  Top 5.08: U$3.+ 52.14,60.71 55.64,57.21 IC4.IP+
  other vias: 51.82,59.94 59.44,53.59 59.44,57.4 59.44,61.21 55.63,59.94 59.44,65.02 59.44,69.47 56.26,68.83 53.72,70.74 49.91,70.74 54.99,62.48 56.26,65.02 54.99,67.56 51.18,68.83
  pour Top (no thermals): 60.71,71.63 60.71,52.45 49.28,52.45 49.28,71.63
  pour Bottom (no thermals): 49.28,71.63 49.28,52.45 60.71,52.45 60.71,71.63
CONEX_11  (1 unrouted)
CONEX_12  (1 unrouted)
CONEX_21  (1 unrouted)
CONEX_22  (1 unrouted)
CONEX_31  (1 unrouted)
CONEX_32  (1 unrouted)
GND  (46 unrouted)
I2C_SCL  (3 unrouted)
  Top 0.406: 127.65,50.78 IC2.5
I2C_SDA  (3 unrouted)
MSHUNT_ADC  (2 unrouted)
MSHUNT_AMP  (1 unrouted)
MSHUNT_B  (1 unrouted)
MSHUNT_M  (1 unrouted)
N$1  (1 unrouted)
N$2  (1 unrouted)
N$3  (1 unrouted)
PV_AIN1  (3 unrouted)
RS485_A  (1 unrouted)
  Top 0.305: R14.1 6.73,49.59 6.73,52.47 8.31,54.05 8.31,64.08 RJ11_1.P$2 9.53,65.41 17.64,65.41 D1.1 21.73,65.26 22.86,64.14 RJ11_2.P$2
  Top 0.406: IC7.6 5.71,45.72 6.67,46.67 R14.1
RS485_B  (1 unrouted)
  Top 0.305: RJ11_1.P$4 10.16,63.5 10.16,60.96 9.4,60.2 9.4,52.9 9.27,52.77 | RJ11_2.P$4 25.4,60.96 21.48,60.96 18.16,57.64 D2.1 17.78,56.64 13.91,52.77 9.27,52.77 | 9.27,52.77 8.57,52.07 R14.2
  Top 0.406: IC7.7 5.71,44.45 8.57,47.3 R14.2
TEMP1  (2 unrouted)
TXEN
  Top 0.305: U$1.4 16.36,32.88 17.4,33.91 17.4,44.32 15.94,45.79 R16.2 13.4,45.72 IC7.3
UART_RX  (1 unrouted)
  Top 0.305: 12.44,40.2 12.44,31.97 11.16,30.7 U$1.RX | 11.68,40.95 R13.1 10.33,41.42 IC7.1
UART_TX
  Top 0.305: 8.69,30.44 8.69,46.28 9.4,46.99 IC7.4
  Top 0.508: U$1.TX 8.69,30.44
VCC_3V3  (27 unrouted)
  Top 0.508: C16.1 4.45,42.72 IC7.8
VCC_5V  (7 unrouted)
VCC_12V  (2 unrouted)
  Top 0.406: IC6.3 IC6.4
  Top 2.54: IC6.4 144.78,20.95 148.59,24.77 J1.2
  pour Top (no thermals): 140.34,19.43 145.92,19.43 149.61,23.11 153.92,23.11 154.94,24.13 154.94,25.4 153.67,26.67 148.21,26.67 143.76,22.23 140.34,22.23 140.08,21.97 140.08,19.68
VCC_BBANK  (1 unrouted)
VCC_PV  (1 unrouted)